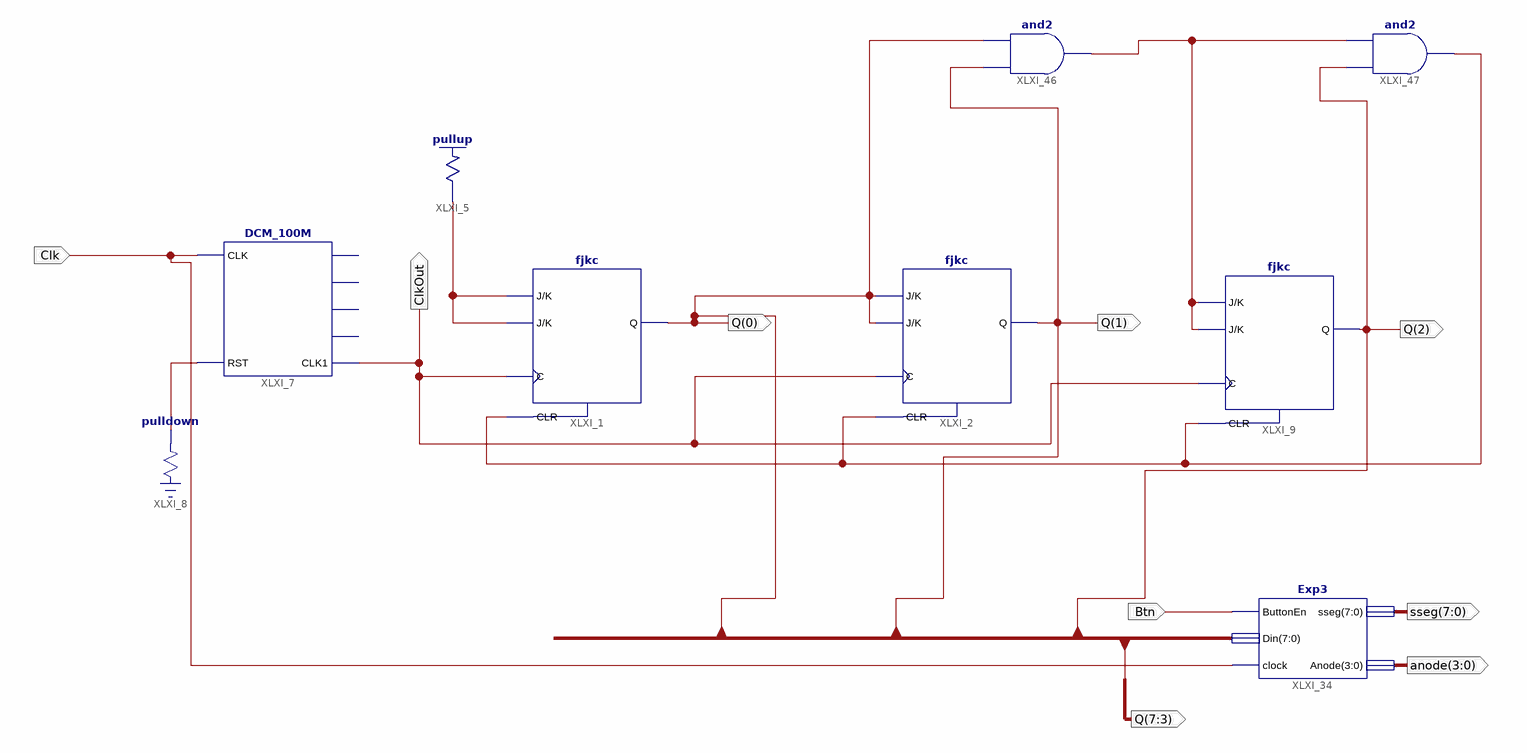
[diagram p0: schematic sheet 1]
// Xilinx ISE schematic Exp3ModCounter.sch (spartan3e) as structural Verilog: 9 symbols, 9 ports
module Exp3ModCounter (
  input  Clk,
  input  Btn,
  output ClkOut,
  output [7:0] Q,
  output [7:0] sseg,
  output [3:0] anode
);

  wire XLXN_1, XLXN_3, XLXN_10, XLXN_55;

  Exp3 XLXI_34 (.ButtonEn(Btn), .Din(Q), .clock(Clk), .sseg(sseg), .Anode(anode));
  fjkc XLXI_1 (.C(ClkOut), .CLR(XLXN_1), .J(XLXN_3), .K(XLXN_3), .Q(Q[0]));
  fjkc XLXI_2 (.C(ClkOut), .CLR(XLXN_1), .J(Q[0]), .K(Q[0]), .Q(Q[1]));
  \pullup  XLXI_5 (.O(XLXN_3));
  DCM_100M XLXI_7 (.CLK(Clk), .RST(XLXN_10), .CLK1(ClkOut));  // open: CLK1M, CLK10k, CLK1k, CLK100
  \pulldown  XLXI_8 (.O(XLXN_10));
  fjkc XLXI_9 (.C(ClkOut), .CLR(XLXN_1), .J(XLXN_55), .K(XLXN_55), .Q(Q[2]));
  and XLXI_46 (XLXN_55, Q[1], Q[0]);
  and XLXI_47 (XLXN_1, Q[2], XLXN_55);
endmodule
